# EAGLE design carte_A (EAGLE 6.5.0)
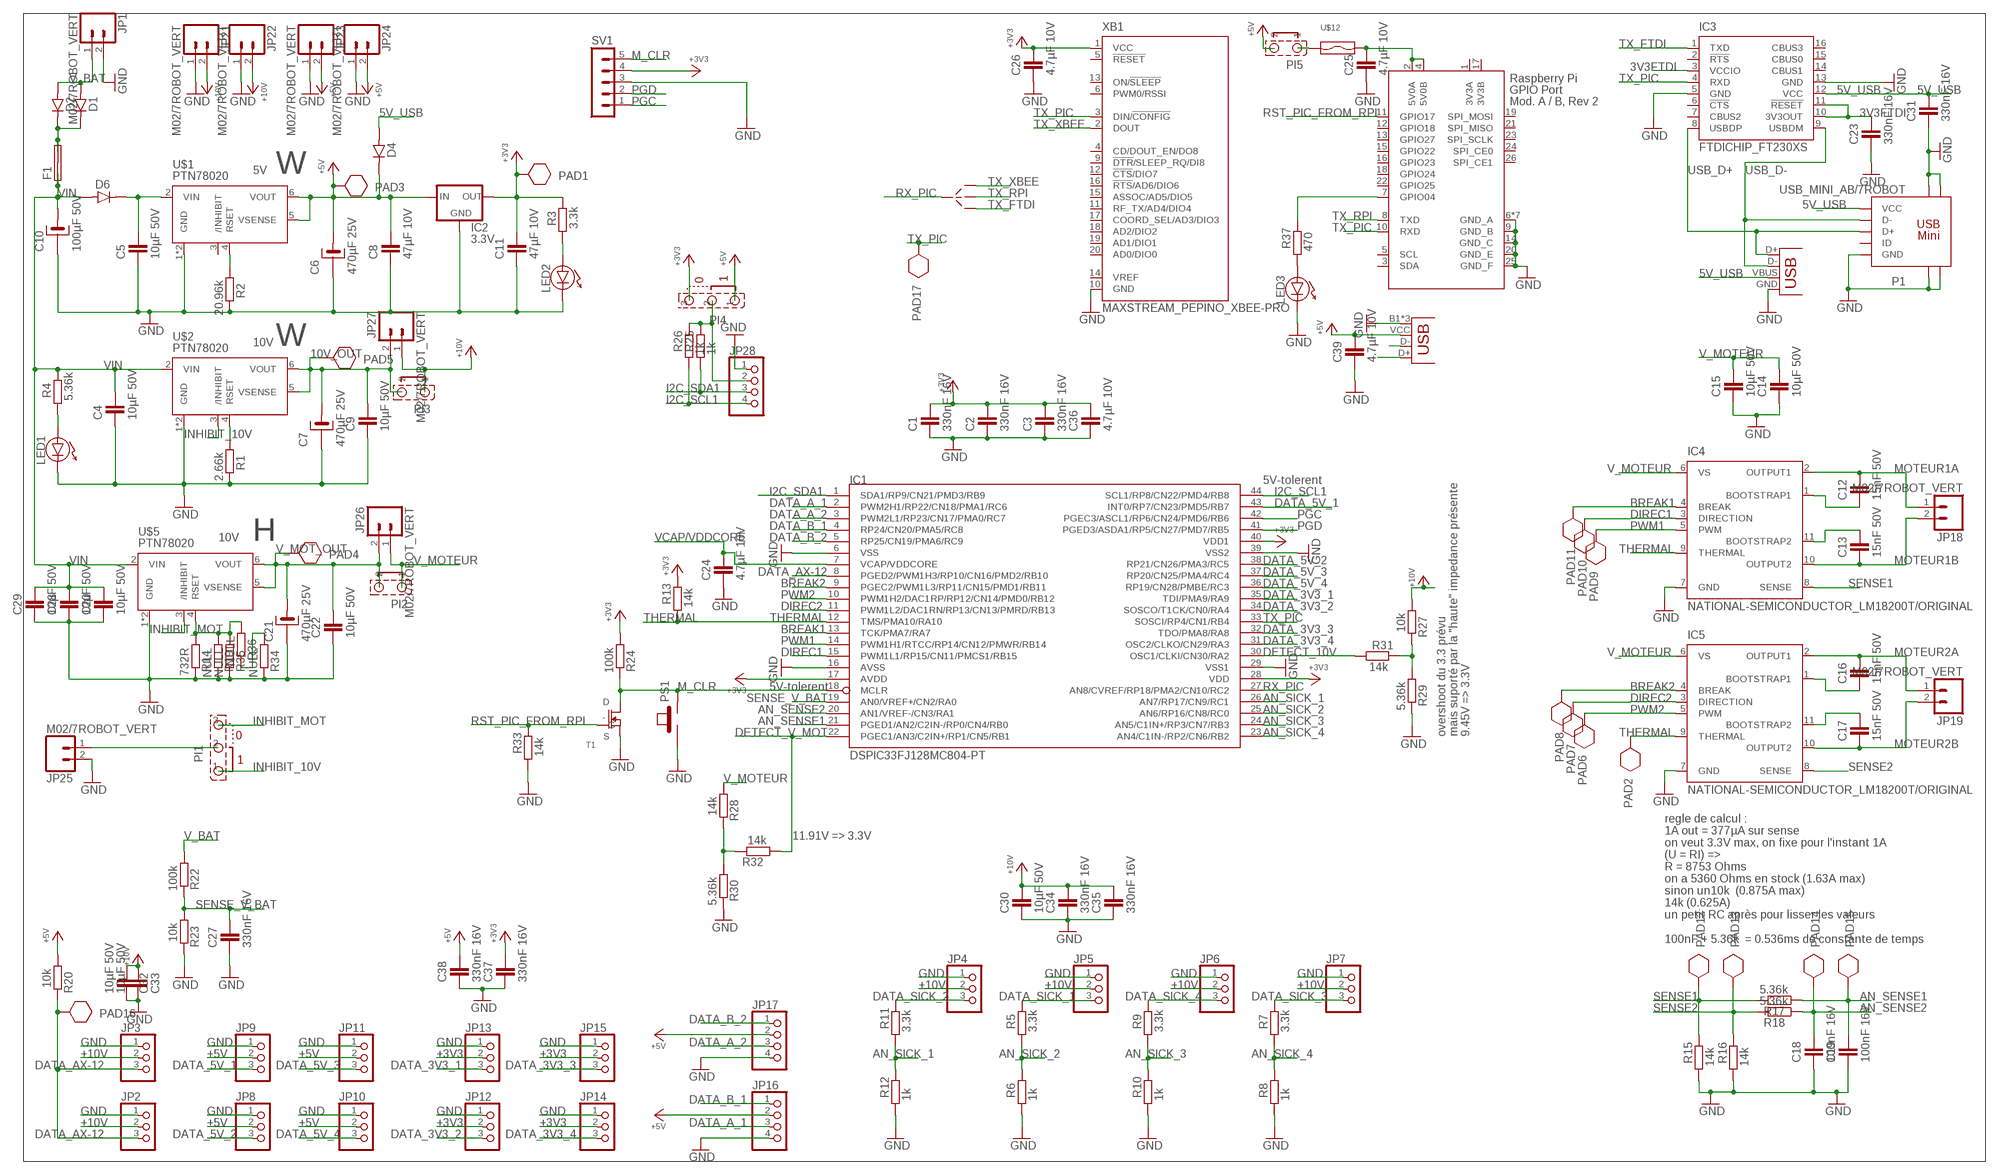
[diagram p0: schematic, sheet 1]

## Parts
C1  330nF 16V  C_CERAMIQUE/0805  [0805]
C2  330nF 16V  C_CERAMIQUE/0805  [0805]
C3  330nF 16V  C_CERAMIQUE/0805  [0805]
C4  10µF 50V  C_CERAMIQUE/1206  [1206]
C5  10µF 50V  C_CERAMIQUE/1206  [1206]
C6  470µF 25V  C_CHIMIQUE/RADIAL_8X10_PAS3.5  [CHIM8P3.5]
C7  470µF 25V  C_CHIMIQUE/RADIAL_8X10_PAS3.5  [CHIM8P3.5]
C8  47µF 10V  C_CERAMIQUE/1210  [1210]
C9  10µF 50V  C_CERAMIQUE/1206  [1206]
C10  100µF 50V  C_CHIMIQUE/RADIAL_8X10_PAS3.5  [CHIM8P3.5]
C11  47µF 10V  C_CERAMIQUE/1210  [1210]
C12  15nF 50V  C_CERAMIQUE/0805  [0805]
C13  15nF 50V  C_CERAMIQUE/0805  [0805]
C14  10µF 50V  C_CERAMIQUE/1206  [1206]
C15  10µF 50V  C_CERAMIQUE/1206  [1206]
C16  15nF 50V  C_CERAMIQUE/0805  [0805]
C17  15nF 50V  C_CERAMIQUE/0805  [0805]
C18  100nF 16V  C_CERAMIQUE/0805  [0805]
C19  100nF 16V  C_CERAMIQUE/0805  [0805]
C20  10µF 50V  C_CERAMIQUE/1206  [1206]
C21  470µF 25V  C_CHIMIQUE/RADIAL_8X10_PAS3.5  [CHIM8P3.5]
C22  10µF 50V  C_CERAMIQUE/1206  [1206]
C23  330nF 16V  C_CERAMIQUE/0805  [0805]
C24  4.7µF 10V  C_CERAMIQUE/0805  [0805]
C25  4.7µF 10V  C_CERAMIQUE/0805  [0805]
C26  4.7µF 10V  C_CERAMIQUE/0805  [0805]
C27  330nF 16V  C_CERAMIQUE/0805  [0805]
C28  10µF 50V  C_CERAMIQUE/1206  [1206]
C29  10µF 50V  C_CERAMIQUE/1206  [1206]
C30  10µF 50V  C_CERAMIQUE/1206  [1206]
C31  330nF 16V  C_CERAMIQUE/0805  [0805]
C32  10µF 50V  C_CERAMIQUE/1206  [1206]
C33  10µF 50V  C_CERAMIQUE/1206  [1206]
C34  330nF 16V  C_CERAMIQUE/0805  [0805]
C35  330nF 16V  C_CERAMIQUE/0805  [0805]
C36  4.7µF 10V  C_CERAMIQUE/0805  [0805]
C37  330nF 16V  C_CERAMIQUE/0805  [0805]
C38  330nF 16V  C_CERAMIQUE/0805  [0805]
C39  4.7µF 10V  C_CERAMIQUE/0805  [0805]
D1  DIODES_DIODE/DO41  [DIODES_DO41]
D2  DIODES_DIODE/DO41  [DIODES_DO41]
D4  DIODES_DIODE/DO41  [DIODES_DO41]
D6  DIODES_DIODE/DO41  [DIODES_DO41]
F1  PORTE_FUSIBLE  [SHK20L]
IC1  DSPIC33FJ128MC804-PT  [TQFP44]
IC2  3.3V  V-REG_78XXS  [V-REG_78XXS]
IC3  FTDICHIP_FT230XS  [FTDICHIP_SSOP16]
IC4  NATIONAL-SEMICONDUCTOR_LM18200T/ORIGINAL  [NATIONAL-SEMICONDUCTOR_TO-220-11]
IC5  NATIONAL-SEMICONDUCTOR_LM18200T/ORIGINAL  [NATIONAL-SEMICONDUCTOR_TO-220-11]
JP1  M02/7ROBOT_VERT  [CONN_5MM]
JP2  PINHD-1X3  [1X03]
JP3  PINHD-1X3  [1X03]
JP4  PINHD-1X3  [1X03]
JP5  PINHD-1X3  [1X03]
JP6  PINHD-1X3  [1X03]
JP7  PINHD-1X3  [1X03]
JP8  PINHD-1X3  [1X03]
JP9  PINHD-1X3  [1X03]
JP10  PINHD-1X3  [1X03]
JP11  PINHD-1X3  [1X03]
JP12  PINHD-1X3  [1X03]
JP13  PINHD-1X3  [1X03]
JP14  PINHD-1X3  [1X03]
JP15  PINHD-1X3  [1X03]
JP16  PINHD-1X4  [1X04]
JP17  PINHD-1X4  [1X04]
JP18  M02/7ROBOT_VERT  [CONN_5MM]
JP19  M02/7ROBOT_VERT  [CONN_5MM]
JP20  USB-B  SPARKFUN-CONNECTORS_USBPTH  [SPARKFUN-CONNECTORS_USB-B-PTH]
JP21  M02/7ROBOT_VERT  [CONN_5MM]
JP22  M02/7ROBOT_VERT  [CONN_5MM]
JP23  M02/7ROBOT_VERT  [CONN_5MM]
JP24  M02/7ROBOT_VERT  [CONN_5MM]
JP25  M02/7ROBOT_VERT  [CONN_5MM]
JP26  M02/7ROBOT_VERT  [CONN_5MM]
JP27  M02/7ROBOT_VERT  [CONN_5MM]
JP28  PINHD-1X4  [1X04]
JP29  USB/VERT  [USB-A-FEMALE_VERTICAL]
LED1  OPTO_OSC_LED/5MM  [OPTO_OSC_LED5]
LED2  OPTO_OSC_LED/5MM  [OPTO_OSC_LED5]
LED3  LED/1206  [LED1206]
P1  USB_MINI_AB/7ROBOT  [USB_MINI_AB_7ROBOT]
PAD1  STRAP_PAD/CMS2  [STRAP_PAD_CMS_2]
PAD2  STRAP_PAD/CMS1_5  [STRAP_PAD_CMS_1_5]
PAD3  STRAP_PAD/CMS2  [STRAP_PAD_CMS_2]
PAD4  STRAP_PAD/CMS2  [STRAP_PAD_CMS_2]
PAD5  STRAP_PAD/CMS2  [STRAP_PAD_CMS_2]
PAD6  STRAP_PAD/CMS1_5  [STRAP_PAD_CMS_1_5]
PAD7  STRAP_PAD/CMS1_5  [STRAP_PAD_CMS_1_5]
PAD8  STRAP_PAD/CMS1_5  [STRAP_PAD_CMS_1_5]
PAD9  STRAP_PAD/CMS1_5  [STRAP_PAD_CMS_1_5]
PAD10  STRAP_PAD/CMS1_5  [STRAP_PAD_CMS_1_5]
PAD11  STRAP_PAD/CMS1_5  [STRAP_PAD_CMS_1_5]
PAD12  STRAP_PAD/CMS1_5  [STRAP_PAD_CMS_1_5]
PAD13  STRAP_PAD/CMS1_5  [STRAP_PAD_CMS_1_5]
PAD14  STRAP_PAD/CMS1_5  [STRAP_PAD_CMS_1_5]
PAD15  STRAP_PAD/CMS1_5  [STRAP_PAD_CMS_1_5]
PAD16  STRAP_PAD/CMS1_5  [STRAP_PAD_CMS_1_5]
PAD17  STRAP_PAD/CMS2  [STRAP_PAD_CMS_2]
PI1  STCMS_3/CMS  [STCMS_3]
PI2  STCMS_2  [STCMS_2]
PI3  STCMS_2  [STCMS_2]
PI4  STCMS_3/CMS  [STCMS_3]
PI5  STCMS_2  [STCMS_2]
PS1  ELECTROMECA_PEPINO_POUSSOIR/D_MINI  [ELECTROMECA_PEPINO_B3F]
R1  2.66k  RES/0805  [0805]
R2  20.96k  RES/0805  [0805]
R3  3.3k  RES/0805  [0805]
R4  5.36k  RES/0805  [0805]
R5  3.3k  RES/0805  [0805]
R6  1k  RES/0805  [0805]
R7  3.3k  RES/0805  [0805]
R8  1k  RES/0805  [0805]
R9  3.3k  RES/0805  [0805]
R10  1k  RES/0805  [0805]
R11  3.3k  RES/0805  [0805]
R12  1k  RES/0805  [0805]
R13  14k  RES/0805  [0805]
R14  732R  RES/0805  [0805]
R15  14k  RES/0805  [0805]
R16  14k  RES/0805  [0805]
R17  5.36k  RES/0805  [0805]
R18  5.36k  RES/0805  [0805]
R19  NULL  RES/0805  [0805]
R20  10k  RES/1206  [1206]
R22  100k  RES/1206  [1206]
R23  10k  RES/1206  [1206]
R24  100k  RES/1206  [1206]
R25  1k  RES/0805  [0805]
R26  1k  RES/0805  [0805]
R27  10k  RES/1206  [1206]
R28  14k  RES/0805  [0805]
R29  5.36k  RES/0805  [0805]
R30  5.36k  RES/0805  [0805]
R31  14k  RES/0805  [0805]
R32  14k  RES/0805  [0805]
R33  14k  RES/0805  [0805]
R34  NULL  RES/0805  [0805]
R35  NULL  RES/0805  [0805]
R36  NULL  RES/0805  [0805]
R37  470  RES/0805  [0805]
SV1  CON-LSTB_MA05-1  [CON-LSTB_MA05-1]
T1  MOS_N/SOT23  [SOT23]
U$1  PTN78020  [PTN78020]
U$2  PTN78020  [PTN78020]
U$5  PTN78020  [PTN78020]
U$9  STCMS_4  [STCMS_4]
U$12  FUSE_REARMABLE/1206  [1206]
X1  RASPI_BOARD_B-#_E6P  [RASPI_BOARD_AB-_EDGES_6DRILL_PAD]
XB1  MAXSTREAM_PEPINO_XBEE-PRO  [MAXSTREAM_PEPINO_XBEE-PRO]

## Nets
3V3FTDI: C23.1 IC3.3(VCCIO) IC3.10(3V3OUT) IC3.11(!RESET)
5V_RPI: C25.1 U$12.2 X1.2(5V0A) X1.4(5V0B)
5V_USB: C31.1 D4.A IC3.12(VCC) JP20.VBUS P1.1(VCC)
10V_OUT: C7.P C9.1 JP27.2 PAD5.P$1 PI3.2 U$2.5(VSENSE) U$2.6(VOUT)
+3V3: C1.1 C2.1 C3.1 C11.1 C26.1 C36.1 C37.1 IC1.17(AVDD) IC1.28(VDD) IC1.40(VDD1) IC2.OUT JP12.2 JP13.2 JP14.2 JP15.2 PAD1.P$1 PI4.3 R3.2 R13.2 R24.1 SV1.4 XB1.1(VCC)
+5V: C6.P C8.1 C38.1 C39.1 D4.K IC2.IN JP8.2 JP9.2 JP10.2 JP11.2 JP16.2 JP17.2 JP23.2 JP24.2 JP29.VCC(VBUS) PAD3.P$1 PI4.1 PI5.2 R20.1 U$1.5(VSENSE) U$1.6(VOUT)
+10V: C30.1 C32.1 C33.1 C34.1 C35.1 JP2.2 JP3.2 JP4.2 JP5.2 JP6.2 JP7.2 JP21.2 JP22.2 JP27.1 PI3.1 R27.1
AN_SENSE1: C19.1 IC1.21(PGED1/AN2/C2IN-/RP0/CN4/RB0) PAD15.P$1 R17.1
AN_SENSE2: C18.1 IC1.20(AN1/VREF-/CN3/RA1) PAD14.P$1 R18.1
AN_SICK_1: IC1.26(AN7/RP17/CN9/RC1) R11.1 R12.2
AN_SICK_2: IC1.25(AN6/RP16/CN8/RC0) R5.1 R6.2
AN_SICK_3: IC1.24(AN5/C1IN+/RP3/CN7/RB3) R9.1 R10.2
AN_SICK_4: IC1.23(AN4/C1IN-/RP2/CN6/RB2) R7.1 R8.2
BREAK1: IC1.13(TCK/PMA7/RA7) IC4.4(BREAK) PAD11.P$1
BREAK2: IC1.9(PGEC2/PWM1L3/RP11/CN15/PMD1/RB11) IC5.4(BREAK) PAD8.P$1
DATA_3V3_1: IC1.35(TDI/PMA9/RA9) JP13.3
DATA_3V3_2: IC1.34(SOSCO/T1CK/CN0/RA4) JP12.3
DATA_3V3_3: IC1.32(TDO/PMA8/RA8) JP15.3
DATA_3V3_4: IC1.31(OSC2/CLKO/CN29/RA3) JP14.3
DATA_5V_1: IC1.43(INT0/RP7/CN23/PMD5/RB7) JP9.3
DATA_5V_2: IC1.38(RP21/CN26/PMA3/RC5) JP8.3
DATA_5V_3: IC1.37(RP20/CN25/PMA4/RC4) JP11.3
DATA_5V_4: IC1.36(RP19/CN28/PMBE/RC3) JP10.3
DATA_A_1: IC1.2(PWM2H1/RP22/CN18/PMA1/RC6) JP16.3
DATA_A_2: IC1.3(PWM2L1/RP23/CN17/PMA0/RC7) JP17.3
DATA_AX-12: IC1.8(PGED2/PWM1H3/RP10/CN16/PMD2/RB10) JP2.3 JP3.3 PAD16.P$1 R20.2
DATA_B_1: IC1.4(RP24/CN20/PMA5/RC8) JP16.1
DATA_B_2: IC1.5(RP25/CN19/PMA6/RC9) JP17.1
DATA_SICK_1: JP5.3 R5.2
DATA_SICK_2: JP4.3 R11.2
DATA_SICK_3: JP7.3 R7.2
DATA_SICK_4: JP6.3 R9.2
DETECT_10V: IC1.30(OSC1/CLKI/CN30/RA2) R31.1
DETECT_V_MOT: IC1.22(PGEC1/AN3/C2IN+/RP1/CN5/RB1) R32.1
DIREC1: IC1.15(PWM1L1/RP15/CN11/PMCS1/RB15) IC4.3(DIRECTION) PAD10.P$1
DIREC2: IC1.11(PWM1L2/DAC1RN/RP13/CN13/PMRD/RB13) IC5.3(DIRECTION) PAD7.P$1
GND: C1.2 C2.2 C3.2 C4.2 C5.2 C6.N C7.N C8.2 C9.2 C10.N C11.2 C14.2 C15.2 C18.2 C19.2 C20.2 C21.N C22.2 C23.2 C24.2 C25.2 C26.2 C27.2 C28.2 C29.2 C30.2 C31.2 C32.2 C33.2 C34.2 C35.2 C36.2 C37.2 C38.2 C39.2 IC1.6(VSS) IC1.16(AVSS) IC1.29(VSS1) IC1.39(VSS2) IC2.GND IC3.5(GND) IC3.13(GND) IC4.7(GND) IC5.7(GND) JP1.2 JP2.1 JP3.1 JP4.1 JP5.1 JP6.1 JP7.1 JP8.1 JP9.1 JP10.1 JP11.1 JP12.1 JP13.1 JP14.1 JP15.1 JP16.4 JP17.4 JP20.GND JP21.1 JP22.1 JP23.1 JP24.1 JP25.2 JP28.1 JP29.B1(GND) JP29.B2(GND) JP29.GND LED1.K LED2.K LED3.K P1.5(GND) P1.SH@1(PT1) P1.SH@2(PT2) P1.SH@3(PT3) P1.SH@4(PT4) PS1.1 R1.2 R2.2 R6.1 R8.1 R10.1 R12.1 R14.2 R15.1 R16.1 R19.2 R23.2 R29.2 R30.2 R33.1 R34.2 R35.2 SV1.3 T1.2(S) U$1.1(GND) U$1.7(GND) U$2.1(GND) U$2.7(GND) U$5.1(GND) U$5.7(GND) X1.6(GND_A) X1.9(GND_B) X1.14(GND_C) X1.20(GND_E) X1.25(GND_F) X1.41(GND_A) X1.42(GND_A) X1.43(GND_A) X1.44(GND_A) X1.45(GND_A) X1.46(GND_A) XB1.10(GND)
I2C_SCL1: IC1.44(SCL1/RP8/CN22/PMD4/RB8) JP28.4 R26.1
I2C_SDA1: IC1.1(SDA1/RP9/CN21/PMD3/RB9) JP28.3 R25.1
INHIBIT_10V: PI1.1 U$2.3(/INHIBIT)
INHIBIT_MOT: PI1.3 U$5.3(/INHIBIT)
M_CLR: IC1.18(MCLR) PS1.4 R24.2 SV1.5 T1.3(D)
MOTEUR1A: C12.1 IC4.2(OUTPUT1) JP18.1
MOTEUR1B: C13.2 IC4.10(OUTPUT2) JP18.2
MOTEUR2A: C16.1 IC5.2(OUTPUT1) JP19.1
MOTEUR2B: C17.2 IC5.10(OUTPUT2) JP19.2
N$1: R2.1 U$1.4(RSET)
N$2: R1.1 U$2.4(RSET)
N$3: LED2.A R3.1
N$4: LED1.A R4.1
N$5: R27.2 R29.1 R31.2
N$6: R34.1 R36.2
N$7: C17.1 IC5.11(BOOTSTRAP2)
N$8: R28.2 R30.1 R32.2
N$10: D1.K D2.K F1.2A F1.2B
N$11: C5.1 D6.K U$1.2(VIN)
N$12: C12.2 IC4.1(BOOTSTRAP1)
N$13: C13.1 IC4.11(BOOTSTRAP2)
N$15: PI5.1 U$12.1
N$16: R14.1 R19.1 R35.1 R36.1 U$5.4(RSET)
N$17: LED3.A R37.1
N$18: C16.2 IC5.1(BOOTSTRAP1)
N$19: JP29.D-
N$20: R37.2 X1.7(GPIO04)
N$22: JP25.1 PI1.2
N$23: JP29.D+
PGC: IC1.42(PGEC3/ASCL1/RP6/CN24/PMD6/RB6) SV1.1
PGD: IC1.41(PGED3/ASDA1/RP5/CN27/PMD7/RB5) SV1.2
PWM1: IC1.14(PWM1H1/RTCC/RP14/CN12/PMWR/RB14) IC4.5(PWM) PAD9.P$1
PWM2: IC1.10(PWM1H2/DAC1RP/RP12/CN14/PMD0/RB12) IC5.5(PWM) PAD6.P$1
RST_PIC_FROM_RPI: R33.2 T1.1(G) X1.11(GPIO17)
RX_PIC: IC1.27(AN8/CVREF/RP18/PMA2/CN10/RC2) U$9.C
SENSE1: IC4.8(SENSE) PAD12.P$1 R15.2 R17.2
SENSE2: IC5.8(SENSE) PAD13.P$1 R16.2 R18.2
SENSE_V_BAT: C27.1 IC1.19(AN0/VREF+/CN2/RA0) R22.2 R23.1
THERMAL: IC1.12(TMS/PMA10/RA10) IC4.9(THERMAL) IC5.9(THERMAL) PAD2.P$1 R13.1
TX_FTDI: IC3.1(TXD) U$9.3
TX_PIC: IC1.33(SOSCI/RP4/CN1/RB4) IC3.4(RXD) PAD17.P$1 X1.10(RXD) XB1.3(DIN/!CONFIG)
TX_RPI: U$9.2 X1.8(TXD)
TX_XBEE: U$9.1 XB1.2(DOUT)
USB_D+: IC3.8(USBDP) JP20.D+ P1.3(D+)
USB_D-: IC3.9(USBDM) JP20.D- P1.2(D-)
V_BAT: D1.A D2.A JP1.1 R22.1
V_I2C: JP28.2 PI4.2 R25.2 R26.2
V_MOT_OUT: C21.P C22.1 JP26.2 PAD4.P$1 PI2.2 U$5.5(VSENSE) U$5.6(VOUT)
V_MOTEUR: C14.1 C15.1 IC4.6(VS) IC5.6(VS) JP26.1 PI2.1 R28.1
VCAP/VDDCORE: C24.1 IC1.7(VCAP/VDDCORE)
VIN: C4.1 C10.P C20.1 C28.1 C29.1 D6.A F1.1A F1.1B R4.2 U$2.2(VIN) U$5.2(VIN)
Unconnected: IC3.2(!RTS) IC3.6(!CTS) IC3.7(CBUS2) IC3.14(CBUS1) IC3.15(CBUS0) IC3.16(CBUS3) P1.4(ID) U$1.3(/INHIBIT) X1.3(SDA) X1.5(SCL) X1.12(GPIO18) X1.13(GPIO27) X1.15(GPIO22) X1.16(GPIO23) X1.18(GPIO24) X1.19(SPI_MOSI) X1.21(SPI_MISO) X1.22(GPIO25) X1.23(SPI_SCLK) X1.24(SPI_CE0) X1.26(SPI_CE1) XB1.4(CD/DOUT_EN/DO8) XB1.5(!RESET) XB1.6(PWM0/RSSI) XB1.9(!DTR!/SLEEP_RQ/DI8) XB1.11(RF_TX/AD4/DIO4) XB1.12(!CTS!/DIO7) XB1.13(ON/!SLEEP) XB1.14(VREF) XB1.15(ASSOC/AD5/DIO5) XB1.16(!RTS!/AD6/DIO6) XB1.17(COORD_SEL/AD3/DIO3) XB1.18(AD2/DIO2) XB1.19(AD1/DIO1) XB1.20(AD0/DIO0)

## Notes on the sheet
- 5V | W
- 10V | W
- 5V-tolerent
- 10V | H
- 5V-tolerent
- overshoot du 3.3 prévu
  mais suporté par la "haute" impedance présente
  9.45V => 3.3V
- 11.91V => 3.3V
- regle de calcul :
  1A out = 377µA sur sense
  on veut 3.3V max, on fixe pour l'instant 1A
  (U = RI) =>
  R = 8753 Ohms
  on a 5360 Ohms en stock (1.63A max)
  sinon un10k  (0.875A max)
  14k (0.625A)
  un petit RC après pour lisser les valeurs
  
  100nF + 5.36k  = 0.536ms de constante de temps

## Power pins joined to a net without a drawn wire
3V3A: X1.1(3V3A)
3V3B: X1.17(3V3B)

## Library data of the parts
C1-C5 C8 C9 C11-C20 C22-C39 = 7robot:C_CERAMIQUE
C6 C7 C10 C21 = 7robot:C_CHIMIQUE
D1 D2 D4 D6 = 7robot:DIODES_DIODE: BAS32L => SOD80
F1 = 7robot:PORTE_FUSIBLE: FUSE HOLDER 5 x 20 mm, SH contact, SHH1 Schukat, E1073 Buerklin; OC_FARNELL: unknown; OC_NEWARK: unknown
IC1 = microchip-dspic33fjxxmc:DSPIC33FJ128MC804: dsPIC33FJ32MC302/304, dsPIC33FJ64MCX02/X04, AND dsPIC33FJ128MCX02/X04 High-Performance, 16-bit Digital Signal Controllers Package:44 Pin TQFP Operating Range: * Up to 40 MIPS operation (at 3.0V -3.6V): - Industrial temperature range (-40°C to +85°C) - Extended temperature range (-40°C to +125°C) High-Performance DSC CPU: * Modified Harvard architecture * C compiler optimized instruction set * 16-bit wide data path * 24-bit wide instructions * Linear program memory addressing up to 4M instruction words * Linear data memory addressing up to 64 Kbytes * 83 base instructions: mostly 1 word/1 cycle * Two 40-bit accumulators with rounding and saturation options * Flexible and powerful addressing modes: - Indirect - Modulo - Bit-Reversed * Software stack * 16 x 16 fractional/integer multiply operations * 32/16 and 16/16 divide operations * Single-cycle multiply and accumulate: - Accumulator write back for DSP operations - Dual data fetch * Up to ±16-bit shifts for up to 40-bit data Direct Memory Access (DMA): * 8-channel hardware DMA * Up to 2 Kbytes dual ported DMA buffer area (DMA RAM) to store data transferred via DMA: - Allows data transfer between RAM and a peripheral while CPU is executing code (no cycle stealing) * Most peripherals support DMA Timers/Capture/Compare/PWM: * Timer/Counters, up to five 16-bit timers: - Can pair up to make two 32-bit timers - One timer runs as a Real-Time Clock with an external 32.768 kHz oscillator - Programmable prescaler * Input Capture (up to four channels): - Capture on up, down or both edges - 16-bit capture input functions - 4-deep FIFO on each capture * Output Compare (up to four channels): - Single or Dual 16-bit Compare mode - 16-bit Glitchless PWM mode * Hardware Real-Time Clock/Calendar (RTCC): - Provides clock, calendar, and alarm functions Interrupt Controller: * 5-cycle latency * Up to 53 available interrupt sources * Up to three external interrupts * Seven programmable priority levels * Five processor exceptions Digital I/O: * Peripheral pin Select functionality * Up to 35 programmable digital I/O pins * Wake-up/Interrupt-on-Change for up to 31 pins * Output pins can drive from 3.0V to 3.6V * Up to 5V output with open drain configuration * All digital input pins are 5V tolerant * 4 mA sink on all I/O pins On-Chip Flash and SRAM: * Flash program memory (up to 128 Kbytes) * Data SRAM (up to 16 Kbytes) * Boot, Secure, and General Security for program Flash System Management: * Flexible clock options: - External, crystal, resonator, internal RC - Fully integrated Phase-Locked Loop (PLL) - Extremely low jitter PLL * Power-up Timer * Oscillator Start-up Timer/Stabilizer * Watchdog Timer with its own RC oscillator * Fail-Safe Clock Monitor * Reset by multiple sources Power Management: * On-chip 2.5V voltage regulator * Switch between clock sources in real time * Idle, Sleep, and Doze modes with fast wake-up Analog-to-Digital Converters (ADCs): * 10-bit, 1.1 Msps or 12-bit, 500 Ksps conversion: - Two and four simultaneous samples (10-bit ADC) - Up to nine input channels with auto-scanning - Conversion start can be manual or synchronized with one of four trigger sources - Conversion possible in Sleep mode - ±2 LSb max integral nonlinearity - ±1 LSb max differential nonlinearity Audio Digital-to-Analog Converter (DAC): - 16-bit Dual Channel DAC module - 100 Ksps maximum sampling rate - Second-Order Digital Delta-Sigma Modulator Comparator Module: * Two analog comparators with programmable input/output configuration CMOS Flash Technology: * Low-power, high-speed Flash technology * Fully static design * 3.3V (±10%) operating voltage * Industrial and Extended temperature * Low power consumption Motor Control Peripherals: * 6-channel 16-bit Motor Control PWM: - Three duty cycle generators - Independent or Complementary mode - Programmable dead-time and output polarity - Edge-aligned or center-aligned - Manual output override control - One Fault input - Trigger for ADC conversions - PWM frequency for 16-bit resolution (@ 40 MIPS) = 1220 Hz for Edge-Aligned mode, 610 Hz for Center-Aligned mode - PWM frequency for 11-bit resolution (@ 40 MIPS) = 39.1 kHz for Edge-Aligned mode, 19.55 kHz for Center-Aligned mode * 2-channel 16-bit Motor Control PWM: - One duty cycle generator - Independent or Complementary mode - Programmable dead time and output polarity - Edge-aligned or center-aligned - Manual output override control - One Fault input - Trigger for ADC conversions - PWM frequency for 16-bit resolution (@ 40 MIPS) = 1220 Hz for Edge-Aligned mode, 610 Hz for Center-Aligned mode - PWM frequency for 11-bit resolution (@ 40 MIPS) = 39.1 kHz for Edge-Aligned mode, 19.55 kHz for Center-Aligned mode * 2-Quadrature Encoder Interface module: - Phase A, Phase B, and index pulse input - 16-bit up/down position counter - Count direction status - Position Measurement (x2 and x4) mode - Programmable digital noise filters on inputs - Alternate 16-bit Timer/Counter mode - Interrupt on position counter rollover/underflow
IC2 = 7robot:V-REG_78XXS: VOLTAGE REGULATOR
IC3 = 7robot:FTDICHIP_FT230X: USB to BASIC UART IC Auto generated by make-symbol-device-package-bsdl.ulp Rev. 43 Source: Data sheet <http://www.ftdichip.com/Support/Documents/DataSheets/ICs/DS_FT230X.pdf>
IC4 IC5 = 7robot:NATIONAL-SEMICONDUCTOR_LM18200T: 3A, 55V H-Bridge Motor Control SourcE: http://cache.national.com/ds/LM/LMD18200.pdf; OC_FARNELL: unknown; OC_NEWARK: unknown
JP1 JP18 JP19 JP21-JP27 = 7robot:M02: Standard 2-pin 2.54 header. Use with - straight break away headers ( PRT-00116) - right angle break away headers (PRT-00553) - swiss pins (PRT-00743) - machine pins (PRT-00117) - female headers (PRT-00115) Molex polarized connector foot print use with: PRT-08233 with associated crimp pins and housings. 2.54_SCREWTERM for use with PRT-10571. 3.5mm Screw Terminal footprints for PRT-08084 5mm Screw Terminal footprints for use with PRT-08433
JP2-JP15 = 7robot:PINHD-1X3: PIN HEADER
JP16 JP17 JP28 = 7robot:PINHD-1X4: PIN HEADER
JP20 = 7robot:SPARKFUN-CONNECTORS_USB: USB Connectors USB-B-PTH is fully proven SKU : PRT-00139/CONN-08278 USB-miniB is fully proven SKU : PRT-00587 USB-A-PCB is untested. USB-A-H is throughly reviewed, but untested. Spark Fun Electronics SKU : PRT-00437 USB-B-SMT is throughly reviewed, but untested. Needs silkscreen touching up. USB-A-S has not been used/tested USB-MB-H has not been used/tested USB-MICROB has been used. CONN-09505; PROD_ID: CONN-08278
JP29 = 7robot:USB: USB Connectors USB-B-PTH is fully proven SKU : PRT-00139/CONN-08278 USB-miniB is fully proven SKU : PRT-00587 USB-A-PCB is untested. USB-A-H is throughly reviewed, but untested. Spark Fun Electronics SKU : PRT-00437 USB-B-SMT is throughly reviewed, but untested. Needs silkscreen touching up. USB-A-S has not been used/tested USB-MB-H has not been used/tested USB-MICROB has been used. CONN-09505
LED1 LED2 = 7robot:OPTO_OSC_LED
LED3 = 7robot:LED
P1 = 7robot:USB_MINI_AB
PAD1-PAD17 = 7robot:STRAP_PAD: Trou métallisé pour une vis
PI1 PI4 = 7robot:STCMS_3
PI2 PI3 PI5 = 7robot:STCMS_2
PS1 = 7robot:ELECTROMECA_PEPINO_POUSSOIR
R1-R20 R22-R37 = 7robot:RES
SV1 = 7robot:CON-LSTB_MA05-1: PIN HEADER; OC_FARNELL: unknown; OC_NEWARK: unknown
T1 = 7robot:MOS_N
U$1 U$2 U$5 = 7robot:PTN78020
U$9 = 7robot:STCMS_4
U$12 = 7robot:FUSE_REARMABLE
X1 = raspberrypi_bastelstube_v13:RASPI_BOARD_B-#: Raspberry Pi GPIO connector with markings for the outer dimensions of the Raspberry Pi board model B+ GPIO connector reduced to 26 pins to match models A and B with different sets of drill holes or mounting pads All pins connected
XB1 = 7robot:MAXSTREAM_PEPINO_XBEE: XBee (TM) /XBee-PRO(TM) OEM RF Modules Source: MaxStream, Inc. xbee_productmanual.pdf; MPN: XBP24-AWI-001; OC_FARNELL: 1337916; OC_NEWARK: 42M2667

## Board
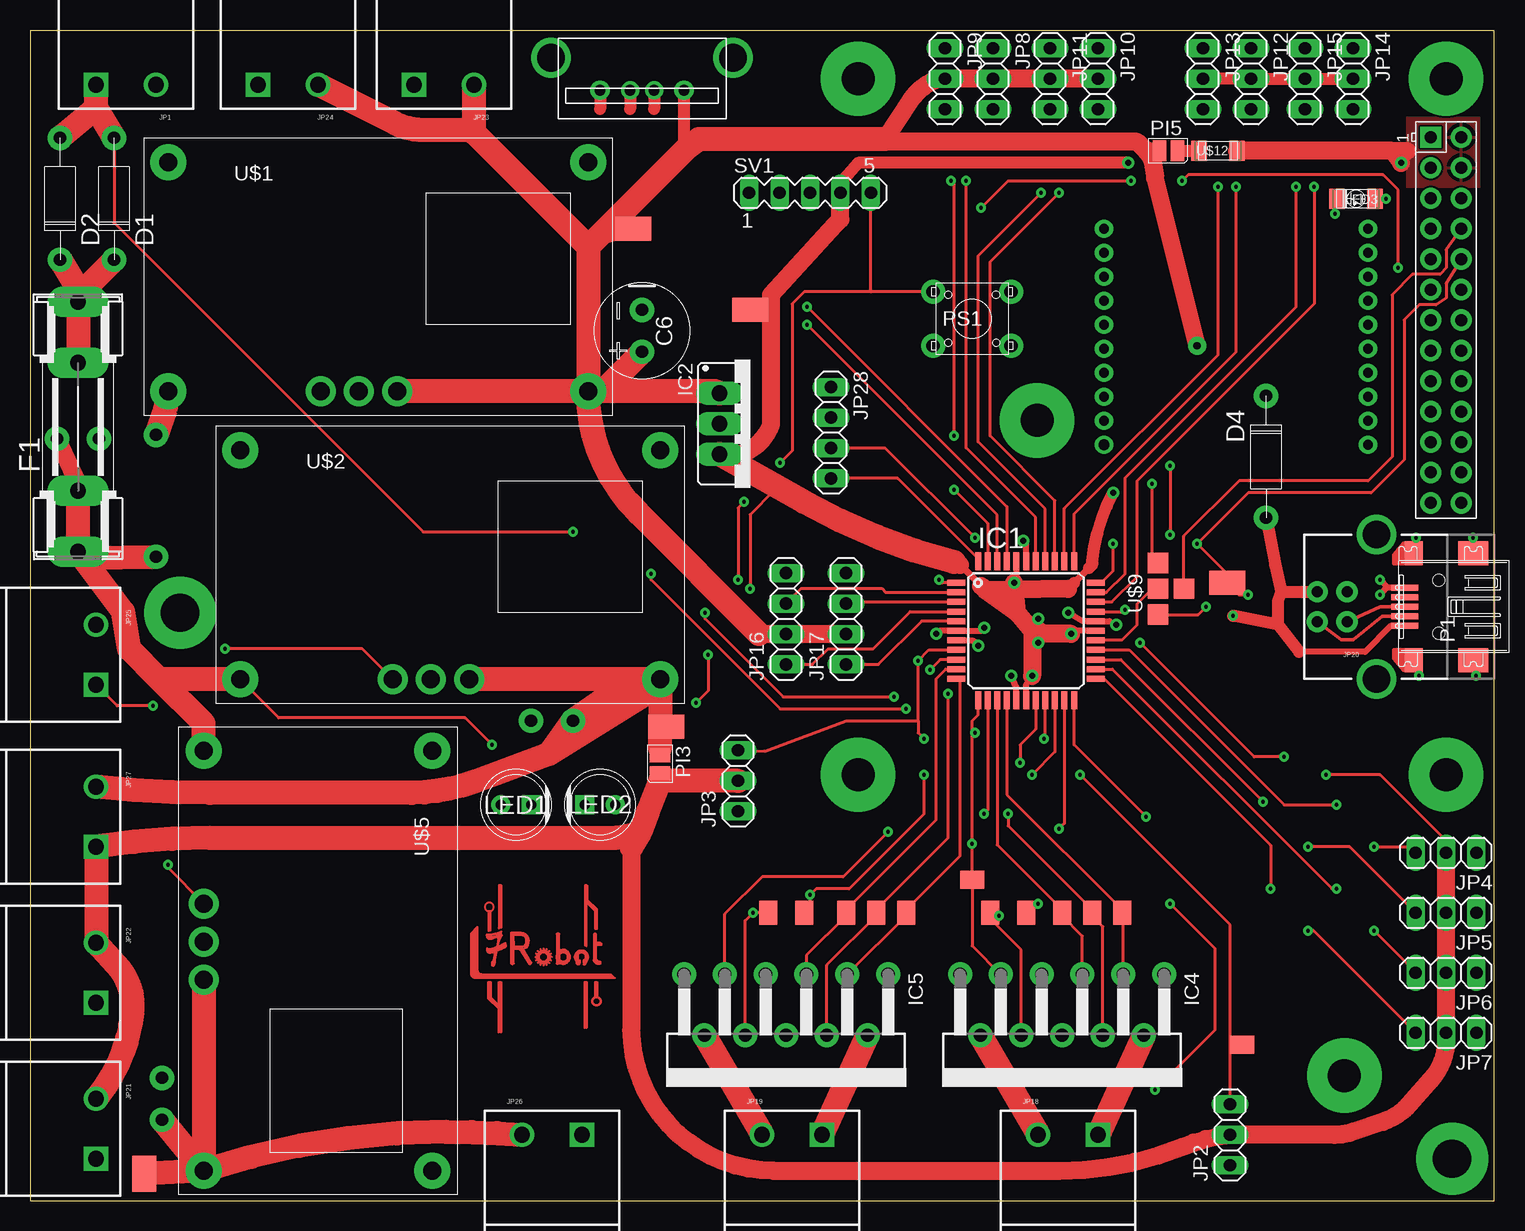
[diagram p1: board, top side]
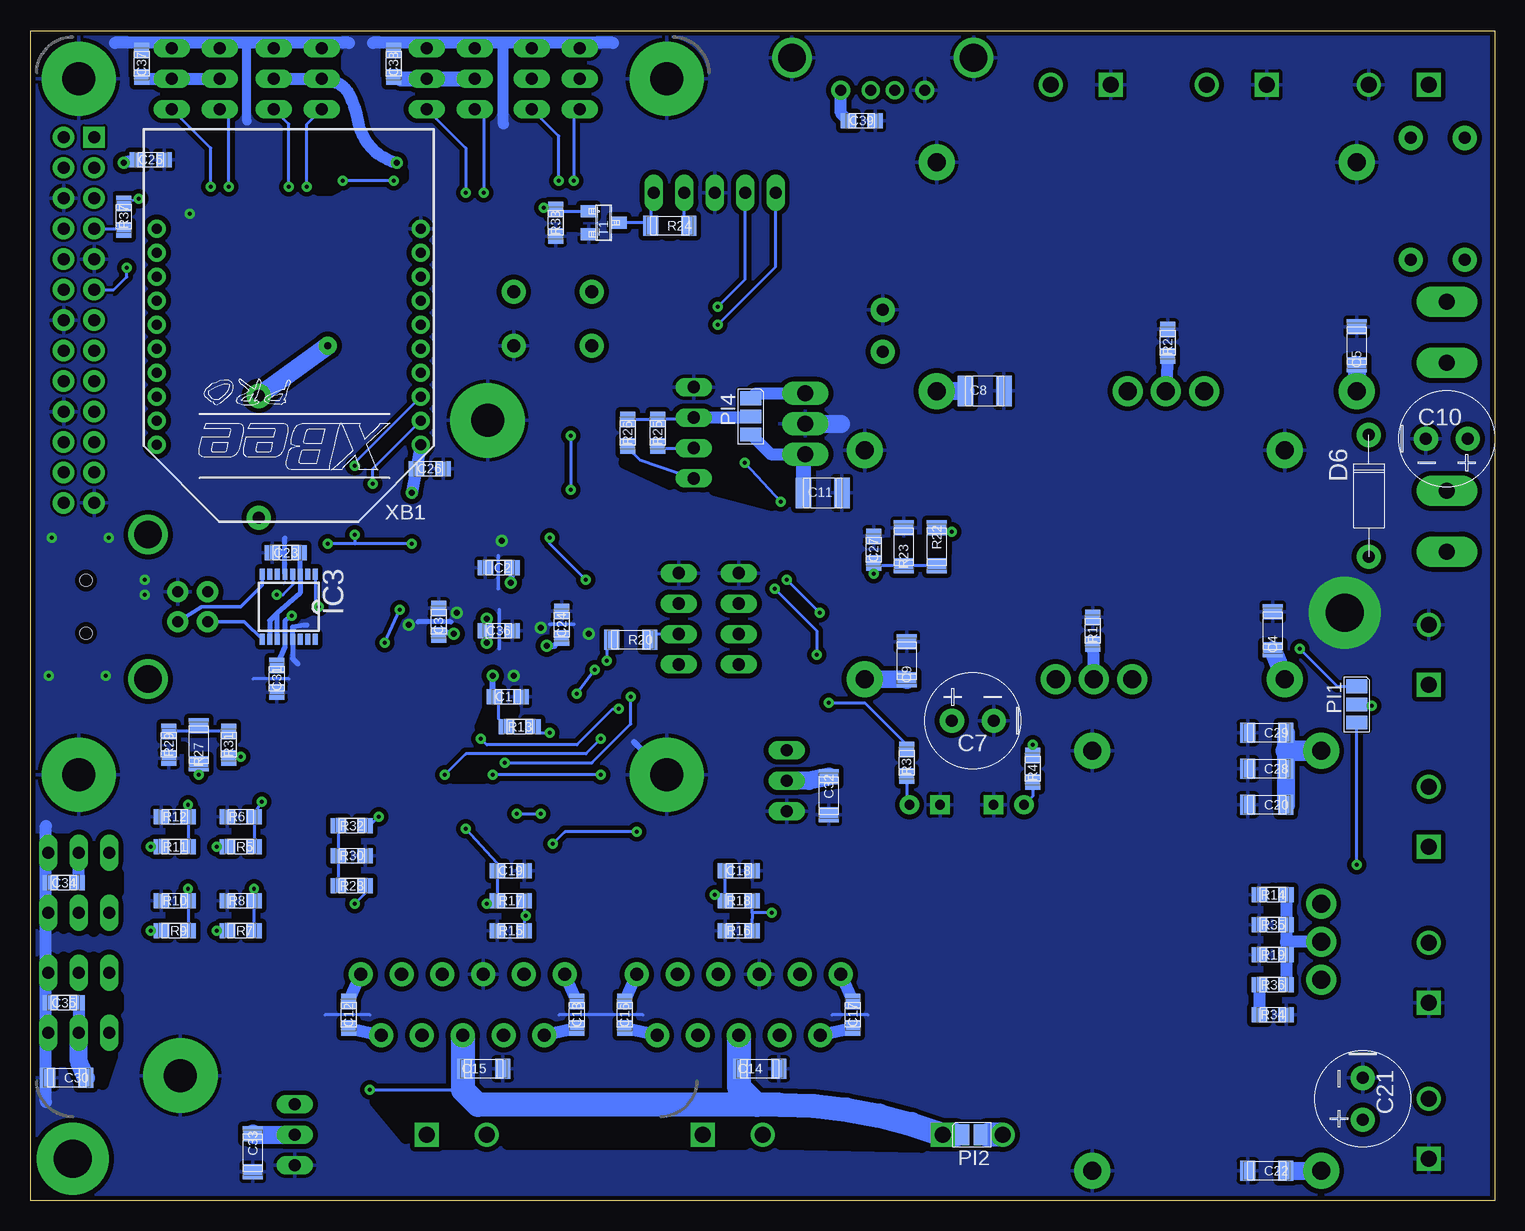
[diagram p2: board, bottom side, seen from below]

Size 122 x 97.5 mm. Coordinates in mm from the lower left corner, seen from the top.
Outline: 0,0 122,0 122,97.5 0,97.5 0,0
Copper layers (1*2+3*4+5*6+7*16): Top 0.035mm / dielectric 0.2mm / Route2 0.035mm / dielectric 0.15mm / Route3 0.035mm / dielectric 0.2mm / Route4 0.035mm / dielectric 0.15mm / Route5 0.035mm / dielectric 0.2mm / Route6 0.035mm / dielectric 0.15mm / Route7 0.035mm / dielectric 0.2mm / Bottom 0.035mm
Design rules "Eagle_WEdirekt_150_check *": minimum track width 0.15mm, minimum drill 0.3mm, track to track 0.15mm, track to pad 0.15mm, pad to pad 0.2mm, via to via 0.15mm, smd to smd 0mil, copper to edge 0.3mm, drill to drill 0.6mm, minimum pad ring 0.225mm, minimum via ring 0.2mm, stop-mask expansion 0.075mm, vias tented up to drill 0mil, thermal gap 0.3mm
bRestrict: 45 lines

### Footprints (pad centres in the part's own frame; a part is rotated, then mirrored left to right if it is on the bottom)
0805 = smd 1.27 x 1.27: 1 -1.111,0; 2 1.111,0
1206 = smd 1.27 x 1.651: 1 -1.587,0; 2 1.587,0
CHIM8P3.5 = drill 1.016 pad 2.032: N 1.746,0; P -1.746,0
1210 = smd 1.27 x 2.54: 1 -1.6,0; 2 1.6,0
DIODES_DO41 = drill 1.016 pad 2.032: A 5.08,0; K -5.08,0
SHK20L = drill 1.321 pad 2.54 long: 1A -10.414,0; 1B -5.334,0; 2A 10.414,0; 2B 5.334,0
TQFP44 = smd 1.5 x 0.5: 1 -5.8,4; 2 -5.8,3.2; 3 -5.8,2.4; 4 -5.8,1.6; 5 -5.8,0.8; 6 -5.8,0; 7 -5.8,-0.8; 8 -5.8,-1.6; 9 -5.8,-2.4; 10 -5.8,-3.2; 11 -5.8,-4; 23 5.8,-4; 24 5.8,-3.2; 25 5.8,-2.4; 26 5.8,-1.6; 27 5.8,-0.8; 28 5.8,0; 29 5.8,0.8; 30 5.8,1.6; 31 5.8,2.4; 32 5.8,3.2; 33 5.8,4 | smd 0.5 x 1.5: 12 -4,-5.8; 13 -3.2,-5.8; 14 -2.4,-5.8; 15 -1.6,-5.8; 16 -0.8,-5.8; 17 0,-5.8; 18 0.8,-5.8; 19 1.6,-5.8; 20 2.4,-5.8; 21 3.2,-5.8; 22 4,-5.8; 34 4,5.8; 35 3.2,5.8; 36 2.4,5.8; 37 1.6,5.8; 38 0.8,5.8; 39 0,5.8; 40 -0.8,5.8; 41 -1.6,5.8; 42 -2.4,5.8; 43 -3.2,5.8; 44 -4,5.8
V-REG_78XXS = drill 1.3 pad 1.8 long: GND 0,-2.54; IN -2.54,-2.54; OUT 2.54,-2.54
FTDICHIP_SSOP16 = smd 0.914 x 0.406: 1 -2.718,2.223; 2 -2.718,1.587; 3 -2.718,0.953; 4 -2.718,0.318; 5 -2.718,-0.318; 6 -2.718,-0.953; 7 -2.718,-1.587; 8 -2.718,-2.223; 9 2.718,-2.223; 10 2.718,-1.587; 11 2.718,-0.953; 12 2.718,-0.318; 13 2.718,0.318; 14 2.718,0.953; 15 2.718,1.587; 16 2.718,2.223
NATIONAL-SEMICONDUCTOR_TO-220-11 = drill 1.1 pad 2: 1 -8.5,-9.37; 2 -6.8,-4.29; 3 -5.1,-9.37; 4 -3.4,-4.29; 5 -1.7,-9.37; 6 0,-4.29; 7 1.7,-9.37; 8 3.4,-4.29; 9 5.1,-9.37; 10 6.8,-4.29; 11 8.5,-9.37
CONN_5MM = drill 1.3 pad 2.032 square: 1 -2.5,0 | drill 1.3 pad 2.032: 2 2.5,0
1X03 = drill 1.016 long: 1 -2.54,0; 2 0,0; 3 2.54,0
1X04 = drill 1.016 long: 1 -3.81,0; 2 -1.27,0; 3 1.27,0; 4 3.81,0
SPARKFUN-CONNECTORS_USB-B-PTH = drill 0.914 pad 1.778: D+ -0.254,1.25; D- 2.235,1.25; GND -0.254,-1.25; VBUS 2.235,-1.25 | drill 2.286: S1 -2.718,-6.02; S2 -2.718,6.02
USB-A-FEMALE_VERTICAL = drill 2.3: B1 -7.57,0; B2 7.57,0 | drill 0.9 pad 1.5: D+ 1,2.7; D- -1,2.7 | drill 0.9 pad 1.6: GND 3.5,2.7; VCC -3.5,2.7
OPTO_OSC_LED5 = drill 0.813 pad 1.6: A -1.27,0 | drill 0.813 pad 1.6 square: K 1.27,0
LED1206 = smd 1.27 x 1.651: A -1.587,0; K 1.587,0
USB_MINI_AB_7ROBOT = smd 0.5 x 2.25: 1 -1.6,8.675; 2 -0.8,8.675; 3 0,8.675; 4 0.8,8.675; 5 1.6,8.675 | smd 2 x 2.5: SH@1 -4.45,3; SH@3 4.45,3 | smd 2 x 1.5: SH@2 -4.45,7.925; SH@4 4.45,7.925 | hole 1: -2.2,5.85; 2.2,5.85
STRAP_PAD_CMS_2 = smd 3 x 2: P$1 0,0
STRAP_PAD_CMS_1_5 = smd 2 x 1.5: P$1 0,0
STCMS_3 = smd 1.727 x 1.143: 1 0,-0.873; 2 0,0.635; 3 0,2.143
STCMS_2 = smd 1.727 x 1.143: 1 0,-0.873; 2 0,0.635
ELECTROMECA_PEPINO_B3F = drill 1.1 pad 2: 1 3.25,-2.25; 2 -3.25,-2.25; 3 3.25,2.25; 4 -3.25,2.25
CON-LSTB_MA05-1 = drill 1.016 long: 1 -5.08,0; 2 -2.54,0; 3 0,0; 4 2.54,0; 5 5.08,0
SOT23 = smd 1.016 x 1.27: 1 0.953,1.27; 2 -0.953,1.27; 3 0,-1.27
PTN78020 = drill 1.5 pad 3: 1 -17.5,9.525; 2 -17.5,-9.525; 6 17.5,-9.525; 7 17.5,9.525 | drill 1.5 pad 2.5: 3 -4.77,-9.525; 4 -1.59,-9.525; 5 1.59,-9.525
STCMS_4 = smd 1.7 x 1.7: 1 0,-2.15; 2 -2.15,0; 3 0,2.15; C 0,0
RASPI_BOARD_AB-_EDGES_6DRILL_PAD = drill 1 pad 1.778 square: 1 8.37,51.23 | drill 1 pad 1.778: 2 8.37,53.77; 3 10.91,51.23; 4 10.91,53.77; 5 13.45,51.23; 6 13.45,53.77; 7 15.99,51.23; 8 15.99,53.77; 9 18.53,51.23; 10 18.53,53.77; 11 21.07,51.23; 12 21.07,53.77; 13 23.61,51.23; 14 23.61,53.77; 15 26.15,51.23; 16 26.15,53.77; 17 28.69,51.23; 18 28.69,53.77; 19 31.23,51.23; 20 31.23,53.77; 21 33.77,51.23; 22 33.77,53.77; 23 36.31,51.23; 24 36.31,53.77; 25 38.85,51.23; 26 38.85,53.77 | drill 2.75 pad 6.2: 41 3.5,3.5; 42 61.5,3.5; 43 61.5,52.5; 44 3.5,52.5; 45 31.965,18.43; 46 86.565,44.03
MAXSTREAM_PEPINO_XBEE-PRO = drill 0.889 pad 1.524: 1 -11,9 | drill 0.8 pad 1.524: 2 -11,7; 3 -11,5; 4 -11,3; 5 -11,1; 6 -11,-1; 7 -11,-3; 8 -11,-5; 9 -11,-7; 10 -11,-9; 11 11,-9; 12 11,-7; 13 11,-5; 14 11,-3; 15 11,-1; 16 11,1; 17 11,3; 18 11,5; 19 11,7; 20 11,9

### Placement (x,y rotation side)
C1  82.25,42 0 bottom
C2  83,52.75 180 bottom
C3  88,48.25 90 bottom
C4  18.5,47.5 90 bottom
C5  11.5,71.25 90 bottom
C6  51,72.5 90 top
C7  43.5,40 0 bottom
C8  42.5,67.5 0 bottom
C9  49,45 90 bottom
C10  4,63.5 180 bottom
C11  56,59 0 bottom
C12  95.5,15.5 90 bottom
C13  76.5,15.5 270 bottom
C14  61.25,11 0 bottom
C15  84.25,11 0 bottom
C16  72.5,15.5 90 bottom
C17  53.5,15.5 270 bottom
C18  63,27.5 0 bottom
C19  82,27.5 0 bottom
C20  19,33 180 bottom
C21  11,8.5 90 bottom
C22  19,2.5 180 bottom
C23  100.75,54 180 bottom
C24  77.75,48 90 bottom
C25  112,86.75 0 bottom
C26  88.75,61 0 bottom
C27  51.75,54.25 90 bottom
C28  19,36 180 bottom
C29  19,39 180 bottom
C30  119,10.25 180 bottom
C31  101.5,43.5 270 bottom
C32  55.5,33.75 270 bottom
C33  103.5,4 270 bottom
C34  119.25,26.5 180 bottom
C35  119.25,16.5 180 bottom
C36  83,47.5 0 bottom
C37  112.75,94.75 90 bottom
C38  91.75,94.75 90 bottom
C39  52.75,90 0 bottom
D1  7,83.5 90 top
D2  2.5,83.5 90 top
D4  103,62 270 top
D6  10.5,58.75 270 bottom
F1  4,64.5 90 top
IC1  83,47.5 0 top
IC2  60,64.75 270 top
IC3  100.5,49.5 270 bottom
IC4  86,9.5 180 top
IC5  63,9.5 180 top
JP1  8,93 0 top
JP2  100,5.5 90 top
JP3  59,35 90 top
JP4  118,29 180 top
JP5  118,24 180 top
JP6  118,19 180 top
JP7  118,14 180 top
JP8  80.25,93.5 270 top
JP9  76.25,93.5 270 top
JP10  89,93.5 270 top
JP11  85,93.5 270 top
JP12  101.75,93.5 270 top
JP13  97.75,93.5 270 top
JP14  110.25,93.5 270 top
JP15  106.25,93.5 270 top
JP16  63,48.5 90 top
JP17  68,48.5 90 top
JP18  86.5,5.5 180 top
JP19  63.5,5.5 180 top
JP20  109.5,49.5 180 top
JP21  5.5,6 90 top
JP22  5.5,19 90 top
JP23  34.5,93 0 top
JP24  21.5,93 0 top
JP25  5.5,45.5 90 top
JP26  43.5,5.5 180 top
JP27  5.5,32 90 top
JP28  66.75,64 270 top
JP29  51,95.25 180 top
LED1  40.5,33 0 top
LED2  47.5,33 180 top
LED3  110.5,83.5 180 top
P1  123.25,49.5 90 top
PAD1  60,74.25 0 top
PAD2  78.5,26.75 0 top
PAD3  50.25,81 0 top
PAD4  9.5,2.25 90 top
PAD5  53,39.5 0 top
PAD6  68,24 90 top
PAD7  73,24 90 top
PAD8  70.5,24 90 top
PAD9  86,24 90 top
PAD10  91,24 90 top
PAD11  88.5,24 90 top
PAD12  80,24 90 top
PAD13  61.5,24 270 top
PAD14  64.5,24 90 top
PAD15  83,24 90 top
PAD16  101,13 0 top
PAD17  99.75,51.5 180 top
PI1  11.5,42 180 bottom
PI2  43.5,5.5 270 bottom
PI3  52.5,36.5 0 top
PI4  62,66 180 bottom
PI5  94.75,87.5 90 top
PS1  78.5,73.5 0 top
R1  33.5,47.5 90 bottom
R2  27.25,71.5 90 bottom
R3  49,36.5 90 bottom
R4  38.5,36 90 bottom
R5  104.5,29.5 180 bottom
R6  104.5,32 0 bottom
R7  104.5,22.5 180 bottom
R8  104.5,25 0 bottom
R9  110,22.5 180 bottom
R10  110,25 0 bottom
R11  110,29.5 180 bottom
R12  110,32 0 bottom
R13  81.25,39.5 180 bottom
R14  18.5,25.5 180 bottom
R15  82,22.5 0 bottom
R16  63,22.5 0 bottom
R17  82,25 0 bottom
R18  63,25 0 bottom
R19  18.5,20.5 180 bottom
R20  72,46.75 180 bottom
R22  46.5,54.5 270 bottom
R23  49.25,54.5 90 bottom
R24  68.75,81.25 180 bottom
R25  69.75,64 90 bottom
R26  72.25,64 90 bottom
R27  108,38 90 bottom
R28  95.25,26.25 180 bottom
R29  110.5,38 270 bottom
R30  95.25,28.75 0 bottom
R31  105.5,38 90 bottom
R32  95.25,31.25 180 bottom
R33  78.25,81.5 90 bottom
R34  18.5,15.5 0 bottom
R35  18.5,23 180 bottom
R36  18.5,18 180 bottom
R37  3.3k  [0805]  114.25,82 270 bottom
SV1  65,84 0 top
T1  74.25,81.5 90 bottom
U$1  29,77 0 top
U$2  35,53 0 top
U$3  [7ROBOT]  43,19.5 0 top
U$5  24,20 270 top
U$9  94,51 180 top
U$12  99,87.5 0 top
X1  65.5,97 270 top
XB1  100.5,72 180 bottom

### Tracks (layer width: path | path; a pad name or v marks a point on that pad's centre or on a via)
3V3FTDI
  Bottom 0.4: IC3.10 102.09,48.34 101.45,48.97 | IC3.11 101.45,48.97 | 101.45,48.97 99.55,50.63 IC3.3 99.55,53.59 C23.1
5V_RPI  (via drill 0.5 pad 1)
  Top 1.5: v114.25,86.5 113.5,87.5 | 113.5,87.5 U$12.2 | 113.5,87.5 114.75,87.5
  Bottom 1: C25.1 v114.25,86.5
  pour Top: 120.75,90.25 114.75,90.25 114.75,84.5 120.75,84.5
5V_USB  (via drill 0.3 pad 0.8)
  Top 0.5: P1.1 113.4,47.9 111.25,45.75 105.75,45.75
  Top 1: 105.75,45.75 104,48 | 104,48 104,50 104.25,50.75 | 104.25,50.75 JP20.VBUS | D4.A 103.75,53 104.25,50.75 | 104,48 v100.25,48.75
  Bottom 0.4: v100.25,48.75 100.82,48.32 IC3.12 100.82,46.18 C31.1
10V_OUT
  Top 1: 52.5,37.75 PI3.2
  Top 2: 50.22,43.48 U$2.5 | 50.22,43.48 U$2.6 52.5,43 | 50.22,43.48 C7.P 43.25,37.25 | 52.5,43 52.5,40 | 52.5,40 PAD5.P$1 | 52.5,37.75 52.5,40 | 43.25,37.25 37.02,34.94 arc-20 31.8,34 15,34 arc-6 JP27.2 | 52.5,43 43.25,37.25
  Bottom 1.5: C9.1 U$2.6
+3V3  (via drill 0.3 pad 0.8, 0.5 pad 1)
  Top 0.25: v60,51 60,57.17 62.06,59.23 64.5,58.25 | v56.5,45.5 56.5,42.5 v55.5,41.5 | PAD1.P$1 61.5,74.25 61.75,74
  Top 0.4: 86.75,47.5 v86.75,47.25
  Top 0.5: IC1.40 82.2,51.55 v82,51.5 | IC1.17 83,43 v83.5,43.75 | IC1.28 86.75,47.5
  Top 0.6: 77.5,53 79.25,51.25 | 88.25,52.75 87,51.5
  Top 0.75: v84,48.5 84,47.5 v84,46.5
  Top 1: v91.5,86.5 69,86.5 67.54,84.79 SV1.4 | 88.25,52.75 88.5,53 88.5,53.25 arc-20 v90.25,59 | 86.5,51 87,51.5 | JP13.2 JP12.2 JP14.2
  Top 1.5: SV1.4 67.54,81.79 61.75,75.5 61.75,74 61.75,64.71 arc-50 59.25,62.21 IC2.OUT | 83.5,47.5 84,47.5 C36.1 84.36,47.25 v86.75,47.25 | 83.5,47.5 82.25,49 | 79.25,51.25 79.62,50.88 | 79.62,50.88 82.25,49 | 82.25,49 v82,51.5 | 77.5,53 77,53.25 | 86.5,51 79.62,50.88 | 83.5,47.5 v83.5,43.75
  Top 2: IC2.OUT 64.5,58.25 arc15 77,53.25
  Bottom 0.25: v60,51 56.5,47.5 v56.5,45.5 | v55.5,41.5 52.5,41.5 49,38 R3.2 | R13.2 83,40.14 IC1.17 83.3,42 C1.1 | R24.1 67.54,81.63 SV1.4
  Bottom 0.5: C1.1 83,42.11 83.5,42.25 v83.5,43.75 | C2.1 81.89,52.61 v82,51.5 | C3.1 87.39,47.39 v86.75,47.25
  Bottom 0.75: 84,47.5 v84,48.5 | C36.1 84,47.5 | 84,47.5 v84,46.5
  Bottom 1: XB1.1 C26.1 v90.25,59 | PI4.3 60.35,62.21 IC2.OUT 57.6,62.21 | JP15.2 JP14.2 112.61,93.5 C37.1 | JP12.2 JP13.2 96.75,93.25 arc49 95.5,92.25 arc17 94.75,90 arc-65 v91.5,86.5
  Bottom 1.25: C11.1 57.6,62.21
+5V  (via drill 0.6 pad 1.5)
  Top 0.406: 55.75,88.5 54.5,88.5
  Top 1: 75.75,93.5 JP9.2 | PAD3.P$1 48.75,80.5 46.75,79.75 | PI5.2 92.86,87.36 93.5,86.75 | 54.5,88.5 JP29.VCC
  Top 1.5: JP10.2 JP11.2 JP8.2 JP9.2 | JP17.2 JP16.2 60.77,47.23 | 75.75,93.5 arc38 73.37,91.68 71.25,88.5 arc90 71.25,88.25 92.25,88.25 93,87.5 | v97.25,71.25 93.75,85.25 93.5,86.75 93,87.5 | 93.25,87.5 93,87.5
  Top 2: U$1.6 U$1.5 | JP24.2 30.44,89.78 arc27 32.68,89.25 37,89.25 | 46.5,79.5 U$1.6 | 46.5,79.5 37,89 37,89.25 | 37,89.25 JP23.2 | 46.5,79.5 46.75,79.75 54.75,87.75 55.75,88.5 71.25,88.5 | IC2.IN 57.02,67.47 47.72,67.47 | 47.72,67.47 U$1.6 | C6.P 47.72,67.47 | 60.77,47.23 50.73,57.27 arc-45 U$1.6
  Bottom 0.25: JP17.2 70.41,47.23 R20.1
  Bottom 1: PI4.1 61.58,67.29 IC2.IN | C39.1 54.5,90.64 JP29.VCC | C38.1 91.14,93.5
  Bottom 1.25: 91.14,93.5 JP11.2
  Bottom 1.5: C8.1 44.12,67.47 U$1.6 | D4.K v97.25,71.25
+10V  (via drill 0.3 pad 0.8)
  Top 0.25: JP4.2 118,30 112.5,35.5 v108,35.5
  Top 1: PI3.1 52.5,35 | 51.51,32.25 51.51,32.44
  Top 1.5: JP4.2 JP5.2 JP6.2 JP7.2 118,13.4 arc-42 116.74,10.08 114.89,8 arc-30 112.73,6.58 110.27,5.76 arc-18 108.69,5.5 JP2.2 arc16 96,4.5 arc-22 85.75,2.5 62,2.5 arc-90 50.12,14.38 50.12,29.5
  Top 2: JP3.2 52.5,35 51.51,32.44 50.88,30.8 | 50.12,29.5 50.88,30.8 | 50.88,30.8 arc-26 48.5,30.25 15,30.25 arc9 JP27.1 JP22.2 7.17,19.69 arc-48 8.5,15.75 arc-34 JP21.2
  Bottom 0.25: v108,35.5 R27.1
  Bottom 1: C34.1 118,26.64 JP4.2 | C35.1 118,16.36 JP7.2
  Bottom 1.5: C30.1 118,11.59 JP7.2 | C32.1 57.16,35 JP3.2 | C33.1 103.41,5.5 JP2.2
AN_SENSE1  (via drill 0.3 pad 0.8)
  Top 0.25: IC1.21 86.2,31.45 v85.75,31 | PAD15.P$1 83.75,24.75 v84,24.75
  Bottom 0.25: v85.75,31 83.11,28.11 C19.1 R17.1 83.36,24.75 v84,24.75
AN_SENSE2  (via drill 0.3 pad 0.8)
  Top 0.25: v74.5,35.5 74.5,32.25 68.25,26 65.5,26 v65,25.5 65,24.5 PAD14.P$1 | IC1.20 85.4,37.4 v83.5,35.5
  Bottom 0.25: 64.11,25.5 R18.1 64.5,25 | C18.1 64.11,27 64.11,25.5 | v74.5,35.5 v83.5,35.5 | v65,25.5 64.11,25.5
AN_SICK_1  (via drill 0.3 pad 0.8)
  Top 0.25: v108.89,33 104.5,33 91.6,45.9 IC1.26
  Bottom 0.25: R11.1 R12.2 v108.89,33
AN_SICK_2  (via drill 0.3 pad 0.8)
  Top 0.25: IC1.25 90.9,45.1 v102.75,33.25
  Bottom 0.25: R5.1 R6.2 103.5,32.11 v102.75,33.25
AN_SICK_3  (via drill 0.3 pad 0.8)
  Top 0.25: IC1.24 90.2,44.3 108.5,26 v108.89,26
  Bottom 0.25: R9.1 R10.2 v108.89,26
AN_SICK_4  (via drill 0.3 pad 0.8)
  Top 0.25: v103.39,26 103.39,29.61 89.5,43.5 IC1.23
  Bottom 0.25: R7.1 R8.2 v103.39,26
BREAK1  (via drill 0.3 pad 0.8)
  Top 0.25: IC1.13 79.8,32.55 v79.5,32.25 | IC4.4 89.4,22.85 88.5,23.75 PAD11.P$1 88.5,24.25 81.5,31.25 v81.5,32.25
  Bottom 0.25: v81.5,32.25 v79.5,32.25
BREAK2  (via drill 0.3 pad 0.8)
  Top 0.25: IC5.4 66.4,19.65 70.5,23.75 PAD8.P$1 70.5,24.25 76.5,30.25 v76.5,42.25 | IC1.9 75.85,45.1 v75,44.25
  Bottom 0.25: v75,44.25 v76.5,42.25
DATA_3V3_1  (via drill 0.3 pad 0.8)
  Top 0.25: IC1.35 86.2,57.7 99,70.5 v99,84.5
  Bottom 0.25: v99,84.5 99,89.71 JP13.3
DATA_3V3_2  (via drill 0.3 pad 0.8)
  Top 0.25: IC1.34 87,57.25 100.5,70.75 v100.5,84.5
  Bottom 0.25: v100.5,84.5 100.5,89.71 JP12.3
DATA_3V3_3  (via drill 0.3 pad 0.8)
  Top 0.25: IC1.32 89.7,50.7 91.25,52.25 91.25,60.25 105.5,74.5 v105.5,84.5
  Bottom 0.25: v105.5,84.5 105.5,90.21 JP15.3
DATA_3V3_4  (via drill 0.3 pad 0.8)
  Top 0.25: IC1.31 90.15,49.9 92.25,52 92.25,60 107,74.75 v107,84.5
  Bottom 0.25: JP14.3 107,87.71 v107,84.5
DATA_5V_1  (via drill 0.3 pad 0.8)
  Top 0.25: v77,59.25 79.8,56.45 IC1.43 | v77,63.75 77,84.75 v76.75,85
  Bottom 0.25: v77,63.75 v77,59.25 | JP9.3 76.75,90.46 v76.75,85
DATA_5V_2  (via drill 0.3 pad 0.8)
  Top 0.25: IC1.38 83.8,56.95 78,62.75 v78,85
  Bottom 0.25: v78,85 78,88.71 JP8.3
DATA_5V_3  (via drill 0.3 pad 0.8)
  Top 0.25: IC1.37 84.6,57.65 79,63.25 79,78.75 v84.25,84
  Bottom 0.25: JP11.3 84.25,90.21 v84.25,84
DATA_5V_4  (via drill 0.3 pad 0.8)
  Top 0.25: IC1.36 85.4,58.35 80,63.75 80,78.25 v85.75,84
  Bottom 0.25: JP10.3 85.75,87.71 v85.75,84
DATA_A_1
  Top 0.25: IC1.2 71.3,50.7 71,51.04 64.27,51.04 JP16.3
DATA_A_2
  Top 0.25: JP17.3 68.13,49.9 IC1.3
DATA_AX-12  (via drill 0.3 pad 0.8)
  Top 0.25: JP2.3 100,13 | 100,13 100,23 v87.5,35.5 | JP3.3 61.21,37.46 68,40 74,40 | PAD16.P$1 100,13 | 74,40 v74,45 74.9,45.9 IC1.8 | 74,40 74,39 v74.5,38.5
  Bottom 0.25: v74.5,38.5 75.75,37.25 85.75,37.25 v87.5,35.5 | R20.2 74,46.75 v74,45
DATA_B_1
  Top 0.25: JP16.1 65.19,44.69 66.5,46 70.25,46 73.35,49.1 IC1.4
DATA_B_2
  Top 0.25: IC1.5 74.3,48.3 70.69,44.69 JP17.1
DATA_SICK_1  (via drill 0.3 pad 0.8)
  Top 0.25: JP5.3 109.96,29.5 v106.5,29.5
  Bottom 0.25: v106.5,29.5 R5.2
DATA_SICK_2  (via drill 0.3 pad 0.8)
  Top 0.25: v112,29.5 114.96,29.5 JP4.3
  Bottom 0.25: R11.2 v112,29.5
DATA_SICK_3  (via drill 0.3 pad 0.8)
  Top 0.25: JP7.3 106.96,22.5 v106.5,22.5
  Bottom 0.25: v106.5,22.5 R7.2
DATA_SICK_4  (via drill 0.3 pad 0.8)
  Top 0.25: JP6.3 115.46,19.04 v112,22.5
  Bottom 0.25: v112,22.5 R9.2
DETECT_10V  (via drill 0.3 pad 0.8)
  Top 0.25: IC1.30 91.15,49.1 v91.25,49.25 | v104.5,37 102,37 v92.5,46.5
  Bottom 0.25: R31.1 104.61,36.89 v104.5,37 | v92.5,46.5 v91.25,49.25
DETECT_V_MOT  (via drill 0.3 pad 0.8)
  Top 0.25: IC1.22 87,38 v93,32
  Bottom 0.25: 94.25,31.36 R32.1 93.75,31.25 v93,32
DIREC1
  Top 0.25: IC1.15 81.4,33.85 91,24.25 PAD10.P$1 91.1,23.9 IC4.3
DIREC2
  Top 0.25: IC1.11 77.5,43.5 77.5,28.75 73.5,24.75 73.5,24.5 PAD7.P$1 | PAD7.P$1 73,23.75 68.12,18.87 IC5.3 | PAD7.P$1 73,24.25
GND  (via drill 0.3 pad 0.8, 0.5 pad 1, 3.2 pad 6)
  Top 0.25: LED3.K 108.91,83.41 v108.75,82.25 | P1.SH@2 115.75,44.38 v115.75,43.75 | P1.SH@1 120.5,45.02 v120.5,43.75 | P1.SH@4 115.5,54.12 v115.5,55.25 | P1.SH@3 v120.25,55.25
  Top 0.5: IC1.16 82.2,42.8 v81.75,43.75 | IC1.39 83,54.75 v82.75,55 | v75.5,47.25 75.75,47.5 IC1.6 79.25,47.5 v79.5,47.75 | P1.5 113.15,51.1 | 113.15,51.1 113,51.1 v112.5,50.5 | v90.5,48 89.95,48.3 IC1.29 87.7,48.3 v86.5,49 | 113.15,51.1 v112.5,51.75
  Top 1: JP29.GND 47.5,91
  Bottom 0.25: JP4.1 120.75,29 | C34.2 120.75,26.5 | JP6.1 120.75,19 120.75,16.89 C35.2 120.75,16.5 | JP7.1 120.75,14 | JP9.1 76.5,96.5 | JP8.1 80.5,96.5 | JP11.1 85,96.5 | JP10.1 89,96.5 | JP13.1 98.25,96.5 | JP12.1 102.25,96.5 | JP15.1 106.25,96.5 | JP14.1 110.25,96.5 | C37.2 112.75,96.5 | 52.25,15.5 55.25,15.5 | 71,15.5 78,15.5 | 93.75,15.5 97.5,15.5 | 100.5,43.5 103.5,43.5 | 100.82,55.25 100.82,54
  Bottom 0.3: 76.75,48.05 78.75,48.05 | 82.95,46 82.95,49.25 | 83.05,53.75 83.05,51
  Bottom 0.4: IC3.5 100.82,55.25 | 99.75,44.75 100.18,45.18 IC3.13 100.18,47.82 99.25,48 99,48 | 100.82,54 101.75,54 | 87,48.25 89.75,48.25
  Bottom 0.406: 92,95.5 C38.2 91.75,96.5
  Bottom 0.5: 71.75,38.25 X1.42
  Bottom 0.75: 104,90 104,96.5
  Bottom 0.9: 82.62,89.75 82.62,96.5
  Bottom 1: 120.75,8.25 120.75,14 120.75,16.5 120.75,19 120.75,26.5 120.75,29 120.75,31.25 | 95.5,96.5 98.25,96.5 102.25,96.5 104,96.5 106.25,96.5 110.25,96.5 112.75,96.5 115,96.5 | 73.5,96.5 76.5,96.5 80.5,96.5 82.62,96.5 85,96.5 89,96.5 91.75,96.5 93.5,96.5
  Bottom 1.5: 57.5,64.75 54.5,64.75
  other vias: 12.5,49
  pour Bottom (isolate 0.4, rank 3): 0.5,97 75.5,97 75.5,93.5 81.25,93.5 81.25,90.5 84.25,90.5 84.25,93.5 93,93.5 93,97 96,97 96,93.5 101.75,93.5 101.75,91 106.25,91 106.25,93.5 114,93.5 114,97 122,97 122,30.75 118,30.75 118,23 121.5,23 121.5,20 118,20 118,11 122,11 122,0.5 0.5,0.5
  pour Bottom (isolate 0.2, rank 2): 115.25,90 121.25,90 121.25,56.5 115.25,56.5
I2C_SCL1
  Top 0.25: IC1.44 79,53.5 72.31,60.19 JP28.4
  Bottom 0.25: R26.1 71.75,62.25 71.25,61.75 JP28.4
I2C_SDA1  (via drill 0.3 pad 0.8)
  Top 0.25: IC1.1 76,51.5 v75.75,51.75 | JP28.3 71.27,62.73 v78.75,55.25
  Bottom 0.25: v75.75,51.75 78.75,54.75 v78.75,55.25 | R25.1 69.59,62.73 JP28.3
INHIBIT_10V  (via drill 0.3 pad 0.8)
  Top 0.25: U$2.3 27.7,46 v16.25,46
  Bottom 0.25: v16.25,46 13.12,42.87 PI1.1
INHIBIT_MOT  (via drill 0.3 pad 0.8)
  Top 0.25: U$5.3 11.5,27.75 v11.5,28
  Bottom 0.25: v11.5,28 PI1.3 | PI1.3
M_CLR  (via drill 0.3 pad 0.8)
  Top 0.25: IC1.18 83.8,39.3 82.5,38 v82.5,36.5 | v59,51.75 59,57.75 v59.5,58.25 | v72,42 62.75,42 56.25,48.5 v56.25,49 | v62.5,61.5 63.5,62.5 63.5,74.75 64.5,75.75 PS1.4 70.08,75.75 SV1.5
  Bottom 0.25: T1.3 72.73,81.75 | v82.5,36.5 75.25,36.5 72,39.75 v72,42 | T1.3 72.58,81.5 | v62.5,61.5 v59.5,58.25 | v59,51.75 v56.25,49 | T1.3 70.59,81.5 R24.2 70.34,83.74 SV1.5
MOTEUR1A
  Top 2: IC4.2 JP18.1
  Bottom 1: C12.1 IC4.2
MOTEUR1B
  Top 2: IC4.10 JP18.2
  Bottom 1: C13.2 IC4.10
MOTEUR2A
  Top 2: JP19.1 IC5.2
  Bottom 1: IC5.2 C16.1
MOTEUR2B
  Top 2: IC5.10 JP19.2
  Bottom 1: C17.2 IC5.10
N$1
  Bottom 1: R2.1 U$1.4
N$2
  Bottom 1: R1.1 U$2.4
N$3
  Bottom 0.25: R3.1 49,33.23 LED2.A
N$4
  Bottom 0.25: R4.1 38.5,33.73 LED1.A
N$5
  Bottom 0.25: R31.2 108,39.11 | 108,39.11 R29.1 | R27.2 108,39.11
N$6
  Bottom 1: R36.2 R34.1
N$7
  Bottom 1: IC5.11 C17.1
N$8
  Bottom 0.25: R32.2 R30.1 R28.2
N$10
  Top 2: D2.K 4,75.92 F1.2A | D1.K 4,75.42 F1.2A | F1.2A F1.2B
N$11
  Top 2: U$1.2 11.25,65.97 D6.K
  Bottom 1.5: C5.1 U$1.2
  Bottom 2: 11.41,67.47 U$1.2
N$12
  Bottom 1: C12.2 IC4.1
N$13
  Bottom 1: C13.1 IC4.11
N$15
  Top 1: PI5.1 U$12.1
N$16
  Bottom 1: R14.1 R35.1 17.39,21.59 | R36.1 R19.1 17.39,21.5 17.39,21.59 | U$5.4 17.39,21.59
N$17  (via drill 0.3 pad 0.8)
  Top 0.25: v113,83.5 LED3.A
  Bottom 0.25: R37.1 113.64,83.36 v113,83.5
N$18
  Bottom 1: C16.2 IC5.1
N$19
  Top 1: JP29.D- 52,91
N$20
  Bottom 0.25: X1.7 114.12,81.01 R37.2
N$21  (via drill 3.2 pad 6)
  other vias: 118.5,3.5
N$22  (via drill 0.3 pad 0.8)
  Top 0.25: v10.25,41.25 7.25,41.25 JP25.1
  Bottom 0.25: PI1.2 11.38,41.25 v10.25,41.25
N$23
  Top 1: JP29.D+ 50,91
PGC  (via drill 0.3 pad 0.8)
  Top 0.25: IC1.42 80.6,57.15 v64.75,73
  Bottom 0.25: v64.75,73 59.92,77.83 SV1.1
PGD  (via drill 0.3 pad 0.8)
  Top 0.25: v64.75,74.5 81.4,57.85 IC1.41
  Bottom 0.25: v64.75,74.5 62.46,76.79 SV1.2
PWM1
  Top 0.25: IC1.14 80.6,29.65 86,24.25 PAD9.P$1 86,23.75 87.7,22.05 IC4.5
PWM2
  Top 0.25: IC1.10 76.3,44.3 75.5,43.5 75.5,31.75 68,24.25 PAD6.P$1 68,23.75 64.7,20.45 IC5.5
RST_PIC_FROM_RPI  (via drill 0.3 pad 0.8)
  Top 0.25: v91.75,85 81.5,85 v79.25,82.75 | v114,77.75 114,84.25 112.75,85.5 96.5,85.5 v96,85
  Bottom 0.25: T1.1 78.41,82.45 R33.2 v79.25,82.75 | X1.11 115.07,75.93 114,77 v114,77.75 | v91.75,85 v96,85
RX_PIC
  Top 0.25: IC1.27 88.85,46.75 91,46.75 92.25,48 92.25,49.75 93.25,50.75 94,50.5 U$9.C
SENSE1  (via drill 0.3 pad 0.8)
  Top 0.25: IC4.8 82.6,20.9 80,23.5 | 80,23.5 v80.75,23.75 | 80,23.5 PAD12.P$1
  Bottom 0.25: R17.2 80.89,23.75 | 80.89,23.75 R15.2 | v80.75,23.75 80.89,23.75
SENSE2  (via drill 0.3 pad 0.8)
  Top 0.25: IC5.8 59.6,23.35 v60.25,24 PAD13.P$1
  Bottom 0.25: R16.2 61.89,23.5 61.89,24 | 61.89,24 R18.2 | v60.25,24 61.89,24
SENSE_V_BAT  (via drill 0.3 pad 0.8)
  Top 0.25: IC1.19 84.6,38.6 v84.5,38.5 | v51.75,52.25 51.75,51.75 62.5,41 v73,41
  Bottom 0.25: v51.75,52.25 C27.1 51.75,52.91 R23.1 R22.2 | v84.5,38.5 84,38 76.5,38 73.5,41 v73,41
THERMAL  (via drill 0.3 pad 0.8)
  Top 0.25: 78.5,39 v78.5,29.75 PAD2.P$1 78.5,21.25 80.9,18.85 IC4.9 | 78.5,39 78.5,40 79,40.5 IC1.12 | IC5.9 57.9,23.9 61,27 67.75,27 v71.5,30.75 | v78.75,39 78.5,39
  Bottom 0.25: R13.1 79.64,39 v78.75,39 | v71.5,30.75 77.5,30.75 v78.5,29.75
TX_FTDI  (via drill 0.3 pad 0.8)
  Top 0.25: U$9.3 97.35,48.85 v98,49.5
  Bottom 0.25: IC3.1 98.28,49.78 v98,49.5
TX_PIC  (via drill 0.3 pad 0.8)
  Top 0.25: v90.25,54.75 90.25,52.5 89.25,51.5 IC1.33 | v95,61.25 v95,55.5 | X1.10 118,76.45 118,75.25 117.16,74.66 115.75,74.66 114.5,73.41 114.5,61.75 111.75,59 101.5,59 v97.25,54.75 99.75,52.25 PAD17.P$1 100.75,50.5 v101.5,50.5
  Bottom 0.25: v95,61.25 95,61.5 XB1.3 | IC3.4 100.18,51.32 101,50.5 v101.5,50.5 | v90.25,54.75 95,54.75 | 95,54.75 v97.25,54.75 | v95,55.5 95,54.75
TX_RPI
  Top 0.25: U$9.2 96.15,55.4 100.75,60 111.5,60 113.5,62 113.5,75.5 115.2,77.2 117.5,77.2 118,77.75 118,79.24 X1.8
TX_XBEE  (via drill 0.3 pad 0.8)
  Top 0.25: U$9.1 93.5,53.65 v93.5,59.75
  Bottom 0.25: XB1.2 93.5,61 v93.5,59.75
USB_D+
  Top 0.3: P1.3 112.5,49.5 JP20.D+
  Bottom 0.3: IC3.8 102.72,51.28 104.5,49.5 107.75,49.5 JP20.D+
USB_D-
  Top 0.3: P1.2 112.7,48.7 110.25,46.75 109.27,46.75 JP20.D-
  Bottom 0.3: JP20.D- 104.19,48.25 IC3.9
V_BAT  (via drill 0.3 pad 0.8)
  Top 0.25: D1.A 7,81.5 32.75,55.75 v45.25,55.75
  Top 2: 5.5,91.08 D2.A | D1.A 5.5,91.08 | 5.5,91.08 JP1.1
  Bottom 0.25: v45.25,55.75 46.61,55.75 R22.1
V_I2C
  Bottom 0.25: JP28.2 65.66,65.11 R25.2 R26.2
  Bottom 1: PI4.2 62.09,65.27 JP28.2
V_MOT_OUT
  Top 2: U$5.5 U$5.6 | U$5.6 C21.P | U$5.6 PAD4.P$1 | JP26.2 arc5 34.71,5.75 arc18 U$5.6
  Bottom 1: PI2.2 42.25,5.5
  Bottom 1.5: C22.1 U$5.6
  Bottom 2: JP26.2 42.25,5.5
V_MOTEUR  (via drill 0.3 pad 0.8)
  Top 0.25: v93.75,9.25 98.75,14.25 98.75,21 v95,24.75
  Bottom 0.25: v93.75,9.25 86,9.25 | R28.1 94,26.11 94,25.75 v95,24.75
  Bottom 0.3: C15.1 86,11 | C14.1 63,11
  Bottom 1: PI2.1 45,5.5
  Bottom 2: 61.5,8 59.54,8 arc21 JP26.1 45,5.5 | 61.5,8 84.75,8 86,9.25 86,11 IC4.6 | IC5.6 63,11 63,9.5 61.5,8
VCAP/VDDCORE  (via drill 0.5 pad 1)
  Top 0.5: IC1.7 78.55,46.7 v79,46.25
  Bottom 0.5: v79,46.25 78.36,46.25 C24.1
VIN  (via drill 0.3 pad 0.8)
  Top 0.25: v38.5,38 36.25,40.25 20.73,40.25 U$2.2
  Top 1.5: F1.1B 4,59.75 C10.P
  Top 2: U$2.2 10.78,43.48 | 10.78,43.48 8.25,46 7.75,49.09 F1.1A | F1.1A F1.1B | F1.1A 4.83,53.59 D6.A | U$5.2 14.47,39.77 10.78,43.48
  Bottom 0.25: R4.2 v38.5,38
  Bottom 1.5: C20.1 C28.1 C29.1 17.41,37.5 | C4.1 U$2.2
  Bottom 1.7: 17.41,37.5 U$5.2

### Text on the board
bStop: VIN | 5V | 5V | 10V | 10V | MOT2 | MOT1
seri_AR: Data / Vcc / GND | I/O 5V | I/O 3V3 | Vin | Pickit | 5V | led / RPi | 3V3 | Rst | I2C | GND / Vcc / SDA / SCL | encodeurs | 1 | TX-PIC | arret d'urgence | GND / A / 5V / B | 1 2 | 10V | UART / XBee / PIC RPi / FTDI | Data / Vcc / GND | Vin 3V3 | AX-12 | Ther | PWM2 | Brk2 | Dir2 | PWM1 | Brk1 | Dir1 | Out 10V | Sense2 | Sense1 | Sicks | Data / Vcc / Gnd | urgence | AX-12 | moteur | Data / Vcc / GND | arret | <MOT2 / MOT1>
seriEAR: toto